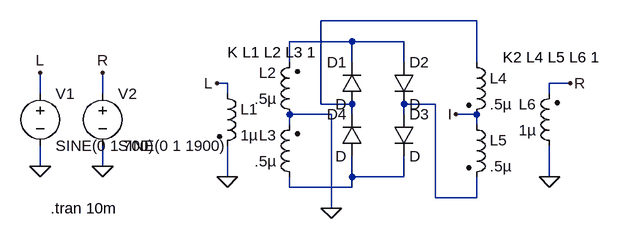
[diagram p0: schematic mixer.asc]
mixer.asc, the LTspice schematic file:
Version 4
SHEET 1 880 680
WIRE 496 16 256 16
WIRE 304 48 208 48
WIRE 384 48 304 48
WIRE 208 80 208 48
WIRE 304 80 304 48
WIRE 384 80 384 48
WIRE 496 80 496 16
WIRE 112 112 96 112
WIRE 640 112 608 112
WIRE -176 128 -176 96
WIRE -80 128 -80 96
WIRE 112 128 112 112
WIRE 608 128 608 112
WIRE 256 144 256 16
WIRE 304 144 256 144
WIRE 432 144 384 144
WIRE 272 160 208 160
WIRE 304 160 304 144
WIRE 384 160 384 144
WIRE 496 160 464 160
WIRE 208 176 208 160
WIRE 496 176 496 160
WIRE -176 240 -176 208
WIRE -80 240 -80 208
WIRE 112 256 112 208
WIRE 304 256 304 224
WIRE 384 256 384 224
WIRE 384 256 304 256
WIRE 608 256 608 208
WIRE 208 272 208 256
WIRE 304 272 304 256
WIRE 304 272 208 272
WIRE 432 288 432 144
WIRE 496 288 496 256
WIRE 496 288 432 288
WIRE 272 304 272 160
FLAG 112 256 0
FLAG 272 304 0
FLAG 608 256 0
FLAG 640 112 R
FLAG 464 160 I
FLAG 96 112 L
FLAG -176 240 0
FLAG -80 240 0
FLAG -176 96 L
FLAG -80 96 R
SYMBOL ind2 96 112 R0
SYMATTR InstName L1
SYMATTR Value 1µ
SYMATTR Type ind
SYMATTR SpiceLine Rser=50
SYMBOL ind2 224 176 R180
WINDOW 0 36 80 Left 2
WINDOW 3 36 40 Left 2
SYMATTR InstName L2
SYMATTR Value .5µ
SYMATTR Type ind
SYMBOL ind2 224 272 R180
WINDOW 0 36 80 Left 2
WINDOW 3 36 40 Left 2
SYMATTR InstName L3
SYMATTR Value .5µ
SYMATTR Type ind
SYMBOL ind2 480 64 R0
SYMATTR InstName L4
SYMATTR Value .5µ
SYMATTR Type ind
SYMBOL ind2 480 160 R0
SYMATTR InstName L5
SYMATTR Value .5µ
SYMATTR Type ind
SYMBOL ind2 624 224 R180
WINDOW 0 36 80 Left 2
WINDOW 3 36 40 Left 2
SYMATTR InstName L6
SYMATTR Value 1µ
SYMATTR Type ind
SYMATTR SpiceLine Rser=50
SYMBOL diode 320 144 R180
WINDOW 0 24 64 Left 2
WINDOW 3 24 0 Left 2
SYMATTR InstName D1
SYMBOL diode 320 224 R180
WINDOW 0 24 64 Left 2
WINDOW 3 24 0 Left 2
SYMATTR InstName D4
SYMBOL diode 368 80 R0
SYMATTR InstName D2
SYMBOL diode 368 160 R0
SYMATTR InstName D3
SYMBOL voltage -176 112 R0
WINDOW 123 0 0 Left 0
WINDOW 39 0 0 Left 0
SYMATTR InstName V1
SYMATTR Value SINE(0 1 700)
SYMBOL voltage -80 112 R0
WINDOW 123 0 0 Left 0
WINDOW 39 0 0 Left 0
SYMATTR InstName V2
SYMATTR Value SINE(0 1 1900)
TEXT 112 64 Left 2 !K L1 L2 L3 1
TEXT 536 72 Left 2 !K2 L4 L5 L6 1
TEXT -160 304 Left 2 !.tran 10m

The netlist it stands for:
* mixer.asc
L1 L 0 1µ Rser=50
L2 0 N002 .5µ
L3 N004 0 .5µ
L4 N001 I .5µ
L5 I N003 .5µ
L6 0 R 1µ Rser=50
D1 N001 N002 D
D4 N004 N001 D
D2 N002 N003 D
D3 N003 N004 D
V1 L 0 SINE(0 1 700)
V2 R 0 SINE(0 1 1900)
.model D D
.lib standard.dio
K L1 L2 L3 1
K2 L4 L5 L6 1
.tran 10m
.backanno
.end

* Results of the author's LTspice run, read from the files saved beside the schematic
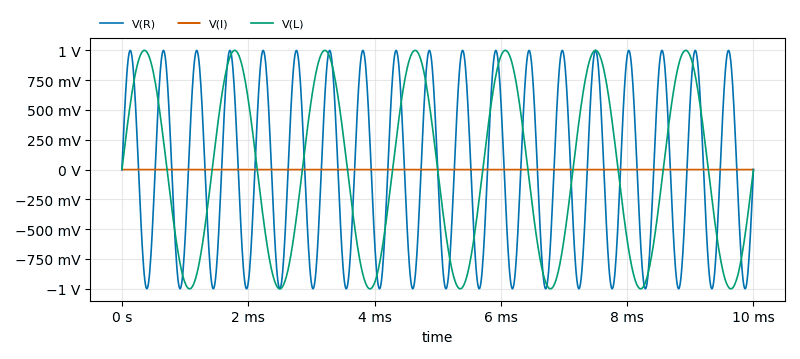
[diagram p1: Transient Analysis of mixer.asc, plotted from the saved traces]
* Transient Analysis, 1 run:
*   V(R): min -999.7 mV, max 999.7 mV, average 0 V, rms 707.1 mV, last 0 V
*   V(I): min -193.2 nV, max 195.3 nV, average -538.7 pV, rms 68.68 nV, last 105.6 nV
*   V(L): min -1 V, max 1 V, average 0 V, rms 707.1 mV, last 0 V